# Altium schematic sheet AI_Audio_Module.SchDoc
size A4; SheetNumber: 9; SheetTotal: 12
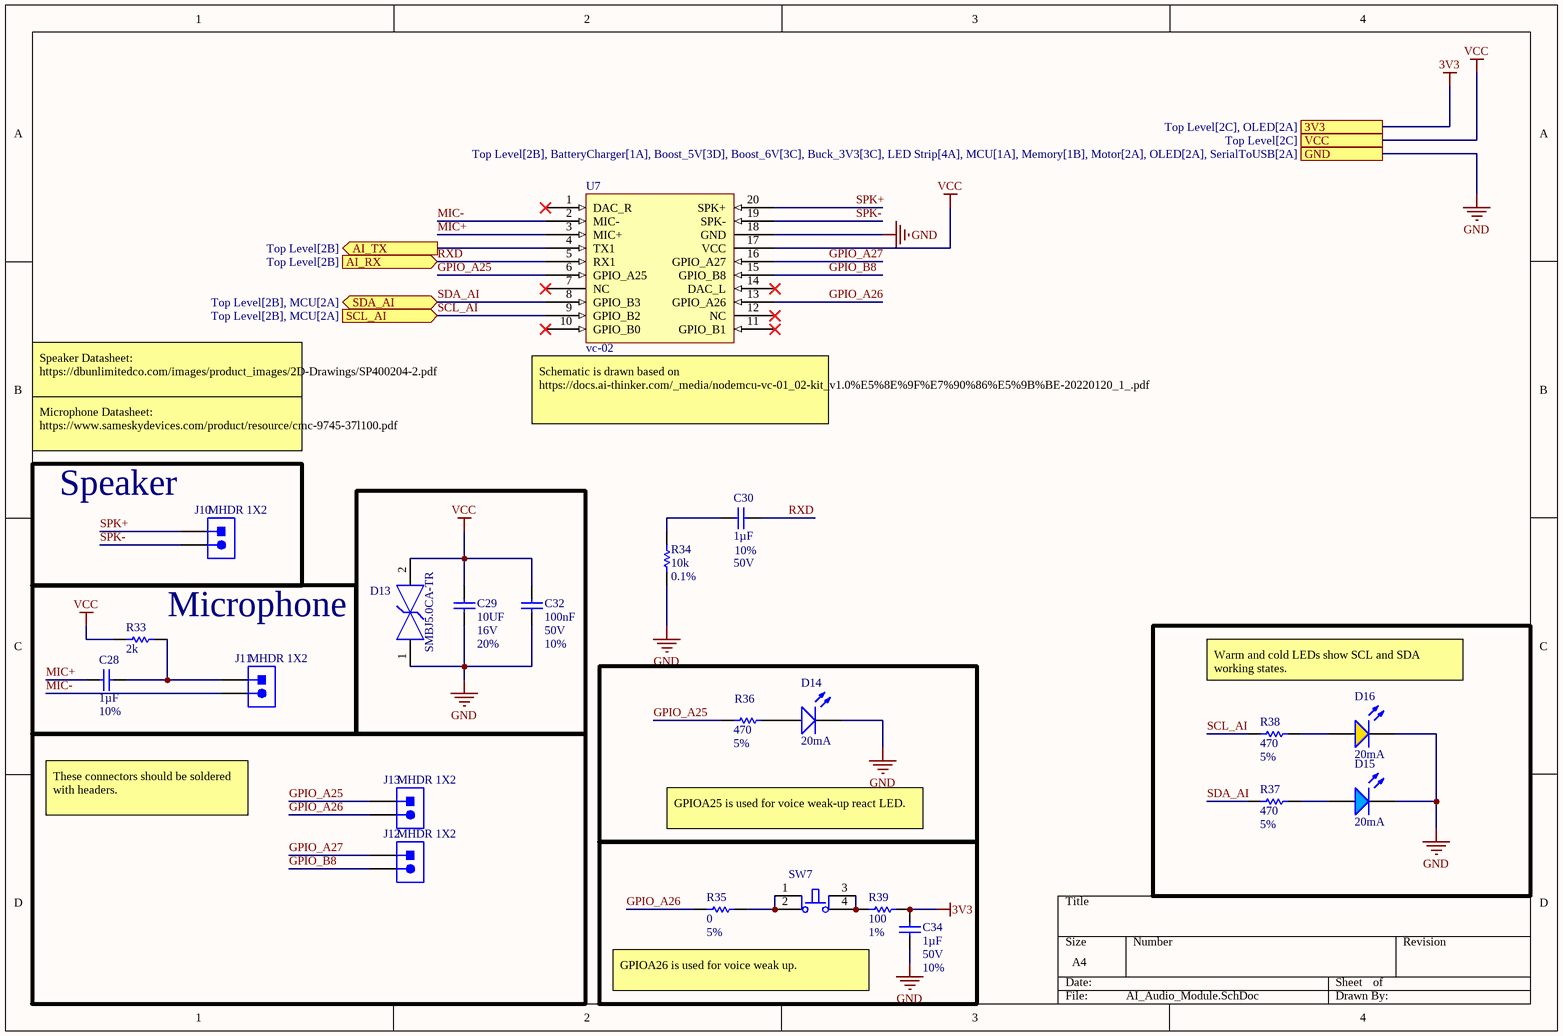
[diagram p0: AI_Audio_Module.SchDoc]

## Parts
C28  value 1µF  Tolerance: 10%  [0603_CAP]  (hidden comment: CAP 0603 1UF 50V 10% X7R)
C29  value 10UF  Voltage: 16V  Tolerance: 20%  [0603_CAP]  (hidden comment: CAP 0603 10UF 16V 20% X5R)
C30  value 1µF  Tolerance: 10%  Voltage: 50V  [0603_CAP]  (hidden comment: CAP 0603 1UF 50V 10% X7R)
C32  value 100nF  Voltage: 50V  Tolerance: 10%  [0603_CAP]  (hidden comment: CAP 0603 0.1UF 50V 10% X7R)
C34  value 1µF  Voltage: 50V  Tolerance: 10%  [0603_CAP]  (hidden comment: CAP 0603 1UF 50V 10% X7R)
D13  SMBJ5.0CA-TR  [FP-SMB-CA-MFG]
D14  Current: 20mA  [LED_0805_WHITE]  (hidden comment: LSM0805543V)
D15  Current: 20mA  [LED_0805_BLUE]  (hidden comment: LSM0805463V)
D16  Current: 20mA  [LED_0805_YELLOW]  (hidden comment: LSM0805472V)
J10  MHDR 1X2  [PH1-02-UA]
J11  MHDR 1X2  [PH1-02-UA]
J12  MHDR 1X2  [PH1-02-UA]
J13  MHDR 1X2  [PH1-02-UA]
R33  value 2k  [0603_RES]  (hidden comment: RES 0603 2K 0.1%)
R34  value 10k  Tolerance: 0.1%  [0603_RES]  (hidden comment: RES 0603 10K 0.1%)
R35  value 0  Tolerance: 5%  [0603_RES]  (hidden comment: RES 0603 0 5%)
R36  value 470  Tolerance: 5%  [0805_RES]  (hidden comment: RES 0805 470 5%)
R37  value 470  Tolerance: 5%  [0805_RES]  (hidden comment: RES 0805 470 5%)
R38  value 470  Tolerance: 5%  [0805_RES]  (hidden comment: RES 0805 470 5%)
R39  value 100  Tolerance: 1%  [0603_RES]  (hidden comment: RES 0603 100 1%)
SW7  PTS810SJK250SMTRLFS  [PTS810SJK250SMTRLFS-Footprint-1]  (value not drawn)
U7  vc-02  [SON180P1700X265-20N]

## Blocks framed on the sheet
Speaker: J10
Microphone: C28 J11 R33

## Ports
3V3 (see Top Level[2C], OLED[2A]), AI_RX (in, see Top Level[2B]), AI_TX (out, see Top Level[2B]), GND (see Top Level[2B], BatteryCharger[1A], Boost_5V[3D], Boost_6V[3C], Buck_3V3[3C], LED Strip[4A], MCU[1A], Memory[1B], Motor[2A], OLED[2A], SerialToUSB[2A]), SCL_AI (in, see Top Level[2B], MCU[2A]), SDA_AI (bidir, see Top Level[2B], MCU[2A]), VCC (see Top Level[2C])

## Nets
3V3: C34.2 R39.2 ; port 3V3
GND: C29.1 C32.1 C34.1 D13.1 D14.K D15.K D16.K R34.1 U7.18(GND) ; port GND
VCC: C29.2 C32.2 D13.2 R33.1 U7.17(VCC) ; port VCC
AI_TX: U7.4(TX1) ; port AI_TX
GPIO_A25: J13.1 R36.1 U7.6(GPIO_A25)
GPIO_A26: J13.2 R35.1 U7.13(GPIO_A26)
GPIO_A27: J12.1 U7.16(GPIO_A27)
GPIO_B8: J12.2 U7.15(GPIO_B8)
MIC+: C28.1 U7.3(MIC+)
MIC-: J11.2 U7.2(MIC-)
RXD: C30.2 U7.5(RX1) ; port AI_RX
SCL_AI: R38.1 U7.9(GPIO_B2) ; port SCL_AI
SDA_AI: R37.1 U7.8(GPIO_B3) ; port SDA_AI
SPK+: J10.1 U7.20(SPK+)
SPK-: J10.2 U7.19(SPK-)
NetC28_2: C28.2 J11.1 R33.2
NetC30_1: C30.1 R34.2
NetD14_A: D14.A R36.2
NetD15_A: D15.A R37.2
NetD16_A: D16.A R38.2
NetR35_2: R35.2 SW7.1 SW7.2
NetR39_1: R39.1 SW7.3 SW7.4

Not connected (* = marked no-connect by the designer): U7 1(DAC_R)* 7(NC)* 10(GPIO_B0)* 11(GPIO_B1)* 12(NC)* 14(DAC_L)*

## Notes on the sheet
- Microphone Datasheet: https://www.sameskydevices.com/product/resource/cmc-9745-37l100.pdf
- Speaker Datasheet: https://dbunlimitedco.com/images/product_images/2D-Drawings/SP400204-2.pdf
- (near U7) Schematic is drawn based on https://docs.ai-thinker.com/_media/nodemcu-vc-01_02-kit_v1.0%E5%8E%9F%E7%90%86%E5%9B%BE-20220120_1_.pdf
- Warm and cold LEDs show SCL and SDA working states.
- These connectors should be soldered with headers.
- GPIOA25 is used for voice weak-up react LED.
- GPIOA26 is used for voice weak up.

## Library data of the parts
C28 C30 = CMP-011-000287-2: Capacitor Surface Mount 0603 Footprint 1UF 50V 10% Tolerance Ceramic X7R; Manufacturer: Various; PCB Package: 0603; Description in Visual: Cap SMT 0603 1UF 50V 10% Ceramic X7R; Capacitor Type: Ceramic; Manufacturer P/N: CAP 0603 1UF 50V 10% X7R; Case/Package: 0603; RoHS: Yes; P/N: CAP 0603 1UF 50V 10% X7R; Mount: SMT; Type: Ceramic X7R
  C28: Voltage: 50V
C29 = CMP-011-000263-1: Capacitor Surface Mount 0603 Footprint 10UF 16V 20% Tolerance Ceramic X5R; Manufacturer: Various; Description in Visual: Cap SMT 0603 10UF 16V 20% Ceramic X5R; PCB Package: 0603; Type: Ceramic X5R; Mount: SMT; P/N: CAP 0603 10UF 16V 20% X5R; Manufacturer P/N: CAP 0603 10UF 16V 20% X5R
C32 = CMP-011-000223-3: Capacitor Surface Mount 0603 Footprint 0.1UF 50V 10% Tolerance Ceramic X7R 100nF; Manufacturer: Various; Description in Visual: Cap SMT 0603 0.1UF 50V 10%  Cer X7R; PCB Package: 0603; Type: Ceramic X7R; Capacitor Type: Ceramic; Manufacturer P/N: CAP 0603 0.1UF 50V 10% X7R; Case/Package: 0603; P/N: CAP 0603 0.1UF 50V 10% X7R; Mount: SMT; RoHS: Yes; JLCPCB Part #: C14663
C34 = CMP-011-000287-2: Capacitor Surface Mount 0603 Footprint 1UF 50V 10% Tolerance Ceramic X7R; Manufacturer: Various; Description in Visual: Cap SMT 0603 1UF 50V 10% Ceramic X7R; PCB Package: 0603; Manufacturer P/N: CAP 0603 1UF 50V 10% X7R; P/N: CAP 0603 1UF 50V 10% X7R; Type: Ceramic X7R; Mount: SMT; Capacitor Type: Ceramic; Case/Package: 0603; RoHS: Yes
D13 = CMP-12225-000020-1: TVS DIODE 5V 13.4V SMB; Manufacturer: STMicroelectronics; Max Junction Temp: +150°C; Number Of Channels: 1; Peak Pulse Current: 68A; Standoff Height: 0.05mm; Direction: Bidirectional; Peak Pulse Power: 600W; Clamping Voltage: 9.2V; Breakdown Voltage: 6.4V; Manufacturer Part Number: SMBJ5.0CA-TR; Device Class L3: unset; Temperature Range Low: -55°C; Digikey Description: TVS DIODE 5V 13.4V SMB; Device Class L2: TVS Diodes; Mouser Description: TVS Diodes - Transient Voltage Suppressors 600W 5.0V Bidirect; Height: 2.65mm; ComponentLink2Description: Datasheet; Lead Free: Yes; RoHS: TRUE; Device Class L1: Circuit Protection; Package: SMB-CA; Reverse Standoff Voltage: 5V; ComponentLink2URL: https://www.st.com/content/ccc/resource/technical/document/datasheet/19/78/91/39/07/cd/40/65/CD00001366.pdf/files/CD00001366.pdf/_jcr_content/translations/en.CD00001366.pdf; Temperature: -55°C to +150°C; Automotive: No; Octopart: https://octopart.com/smbj5.0ca-tr-stmicroelectronics-347080; Temperature Range High: +150°C; Category: Diode
D14 = CMP-00535-1: LED Uni-Color Blue 469nm Automotive 2-Pin Chip 0805(2012Metric) T/R; Forward Voltage: 3V; Package (Case): 0805; Millicandela Rating: 280m; Color: White; Test Current: 20mA; RoHS Compliant: Yes
D15 = CMP-00457-1: LED Uni-Color Blue 469nm Automotive 2-Pin Chip 0805(2012Metric) T/R; Package (Case): 0805; Color: Bllue; Forward Voltage: 3V; Wavelength - Dominant: 469nm; Wavelength - Peak: 469nm; Test Current: 20mA; RoHS Compliant: Yes
D16 = CMP-031-000001-1: LED Uni-Color Yellow 590nm Automotive 2-Pin Chip 0805(2012Metric) T/R; Forward Voltage: 2V; RoHS Compliant: Yes; Test Current: 20mA; Color: Yellow
J10-J13 = CMP-000021-1: Header, 2-Pin, 0.1in Pitch, Male
R33 = CMP-005-002832-2: Resistor Surface Mount, 2K Ohms, 0603 Footprint, 0.1% Tolerance 0.1W; Manufacturer: Various; Description in Visual: Res SMT 2K 0603  0.1%  0.1W; PCB Package: 0603; Power Rating: 0.1W; Mount: SMT; Tolerance: 0.1%; Manufacturer P/N: RES 0603 2K 0.1%
R34 = CMP-005-002155-2: Resistor Surface Mount, 10K Ohms, 0603 Footprint, 0.1% Tolerance 0.1W; Manufacturer: Various; PCB Package: 0603; Description in Visual: Res SMT 10K 0603  0.1%  0.1W; Manufacturer P/N: RES 0603 10K 0.1%; Power Rating: 0.1W; Mount: SMT
R35 = CMP-005-001964-4: Resistor Surface Mount, 0 Ohms, 0603 Footprint, 5% Tolerance 0.1W; Manufacturer P/N: RES 0603 0R 5%; Manufacturer: Various; PCB Package: 0603; Description in Visual: Res SMT 0 0603  5%  0.1W; Power Rating: 0.1W; Mount: SMT; JLCPCB Part #: C21189
R36-R38 = CMP-005-005144-2: Resistor Surface Mount, 470 Ohms, 0805 Footprint, 5% Tolerance 0.125W; Manufacturer P/N: RES 0805 470R 5%; Manufacturer: Various; PCB Package: 0805; Description in Visual: Res SMT 470 0805  5%  0.125W; Mount: SMT; Power Rating: 0.125W
R39 = CMP-005-002125-2: Resistor Surface Mount, 100 Ohms, 0603 Footprint, 1% Tolerance 0.1W; Manufacturer P/N: RES 0603 100R 1%; Manufacturer: Various; Description in Visual: Res SMT 100 0603  1%  0.1W; PCB Package: 0603; Power Rating: 0.1W; Mount: SMT
SW7 = CMP-00084-6: Keypad Switch, 1 Switches, SPST, Momentary tactile button, 0.05A, 16VDC, 3.23N, Solder Terminal, Surface Mount-straight; Manufacturer Series: PTS810; Actuator Length: 0.028inch; Electrical Life: 50000Cycles; Contact Resistance: 0.5mR; Solderability: REFLOW; Actuator Travel: 0.1524mm; Actuator Color: White; Actuator Type: Pushbutton; Insulation Resistance: 100MR; Dielectric Withstand Volts: 250VACV; Switch Function: OFF-MOM; Reach SVHC Compliant: Yes; Terminal Finish: Silver; Switch Type: Keypad; Switch Action: MOMENTARY; RoHS Compliant: Yes; JESD-609 Code: e4; Max Operating Temperature: 85°C; Termination: Solder; Min Operating Temperature: -40°C; Mounting Technology: Surface Mount; Circuit: SPST; Type: Tactile
U7 = CMP-00713-2: AI Audio Module